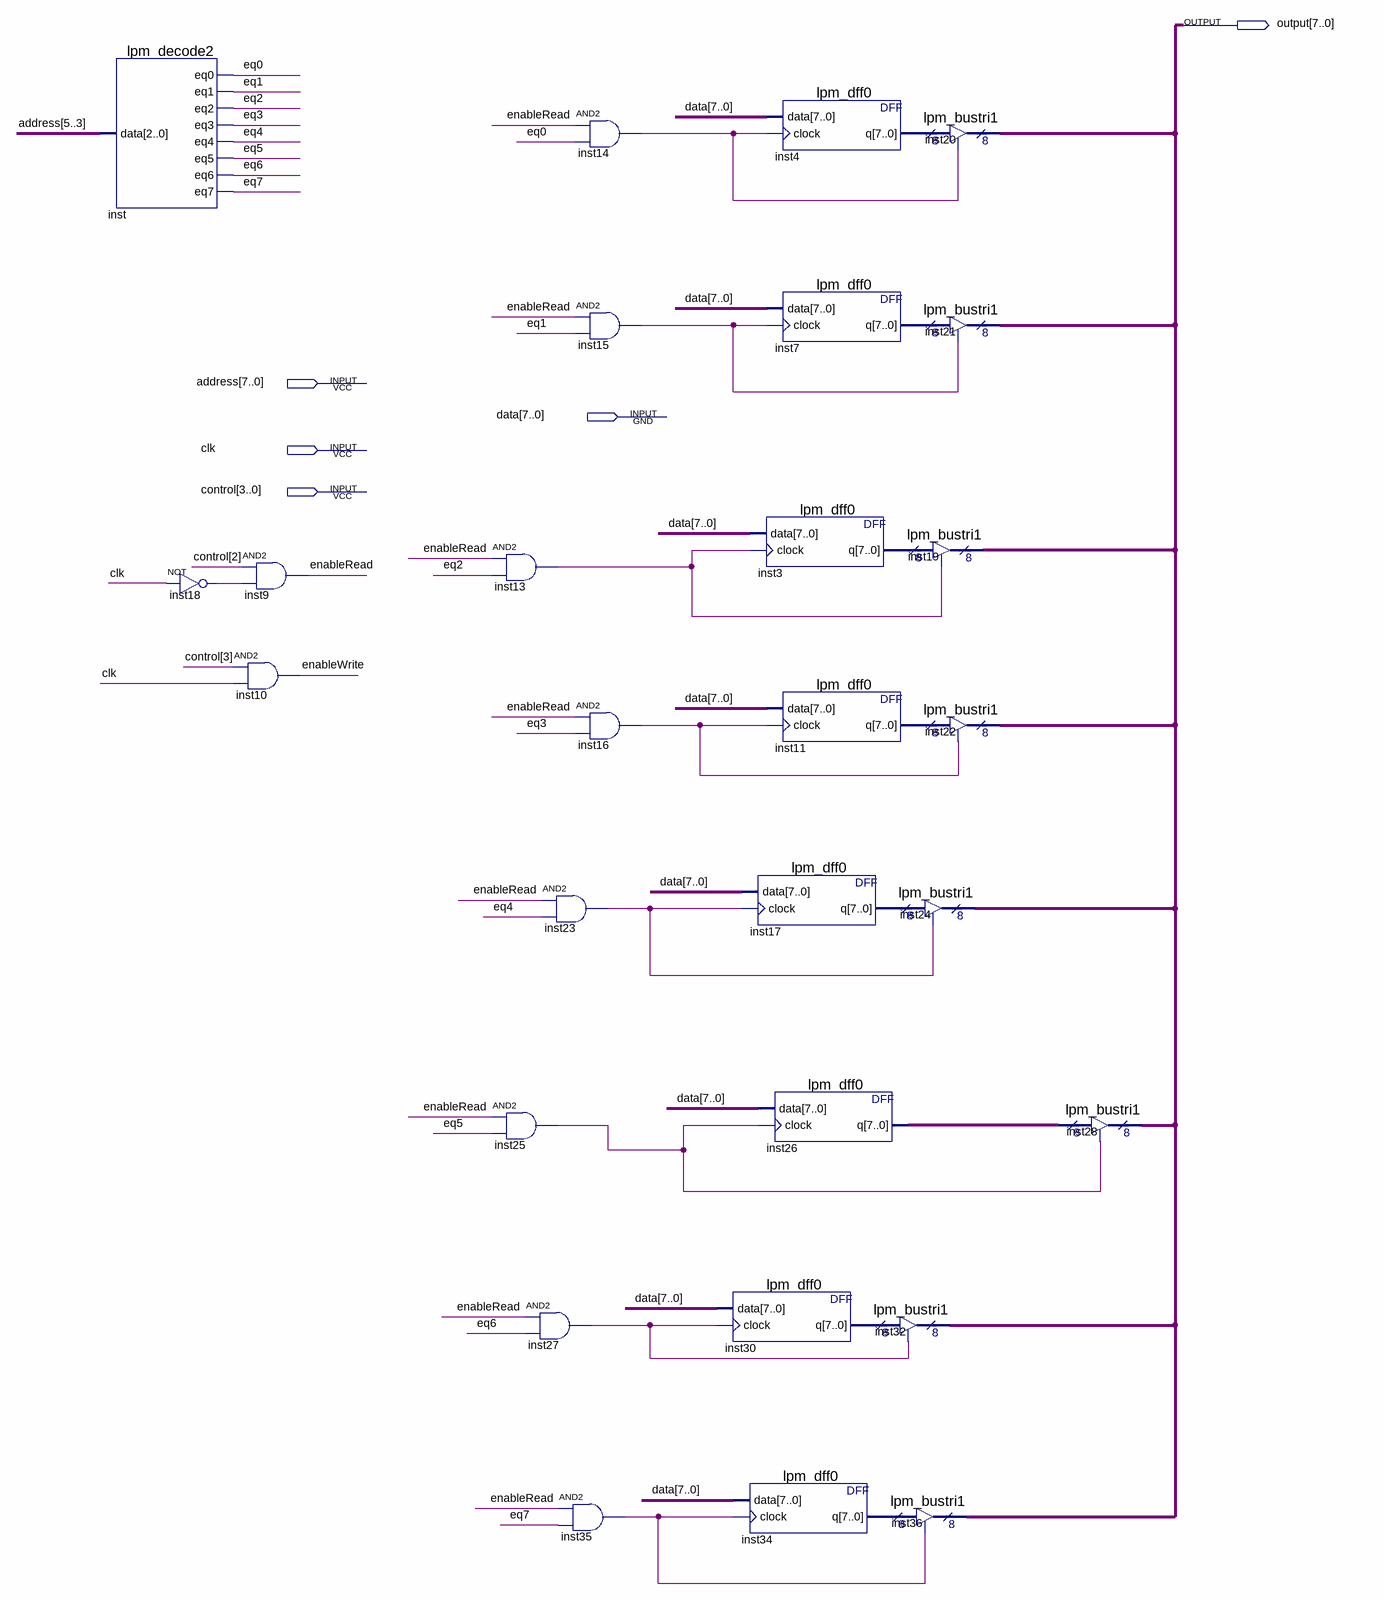
[diagram p0: schematic sheet]
// Quartus schematic POH.bdf as structural Verilog: 28 symbols, 5 pins
module POH (
  input  [7:0] address,
  input  [7:0] data,
  input  clk,
  input  [3:0] control,
  output [7:0] \output 
);

  wire enableRead, enableWrite, eq0, eq1, eq2, eq3, eq4, eq5, eq6, eq7, inst13_out, inst14_out, inst15_out,
       inst16_out, inst18_out, inst23_out, inst25_out, inst27_out, inst35_out;
  wire [7:0] inst3_q, inst4_q, inst7_q, inst11_q, inst17_q, inst26_q, inst30_q, inst34_q;

  lpm_decode2 inst (
    .data(address[5:3]), .eq0(eq0), .eq1(eq1), .eq2(eq2), .eq3(eq3), .eq4(eq4), .eq5(eq5), .eq6(eq6),
    .eq7(eq7));
  not inst18 (inst18_out, clk);
  and inst9 (enableRead, control[2], inst18_out);
  and inst10 (enableWrite, control[3], clk);
  and inst13 (inst13_out, enableRead, eq2);
  and inst23 (inst23_out, enableRead, eq4);
  and inst25 (inst25_out, enableRead, eq5);
  and inst27 (inst27_out, enableRead, eq6);
  and inst14 (inst14_out, enableRead, eq0);
  and inst15 (inst15_out, enableRead, eq1);
  and inst16 (inst16_out, enableRead, eq3);
  and inst35 (inst35_out, enableRead, eq7);
  lpm_dff0 inst17 (.data(data), .clock(inst23_out), .q(inst17_q));
  lpm_dff0 inst30 (.data(data), .clock(inst27_out), .q(inst30_q));
  lpm_dff0 inst34 (.data(data), .clock(inst35_out), .q(inst34_q));
  lpm_dff0 inst4 (.data(data), .clock(inst14_out), .q(inst4_q));
  lpm_dff0 inst7 (.data(data), .clock(inst15_out), .q(inst7_q));
  lpm_dff0 inst3 (.data(data), .clock(inst13_out), .q(inst3_q));
  lpm_dff0 inst11 (.data(data), .clock(inst16_out), .q(inst11_q));
  lpm_dff0 inst26 (.data(data), .clock(inst25_out), .q(inst26_q));
  lpm_bustri1 inst32 (.enabledt(inst27_out), .data(inst30_q), .tridata(\output ));
  lpm_bustri1 inst20 (.enabledt(inst14_out), .data(inst4_q), .tridata(\output ));
  lpm_bustri1 inst21 (.enabledt(inst15_out), .data(inst7_q), .tridata(\output ));
  lpm_bustri1 inst19 (.enabledt(inst13_out), .data(inst3_q), .tridata(\output ));
  lpm_bustri1 inst22 (.enabledt(inst16_out), .data(inst11_q), .tridata(\output ));
  lpm_bustri1 inst24 (.enabledt(inst23_out), .data(inst17_q), .tridata(\output ));
  lpm_bustri1 inst36 (.enabledt(inst35_out), .data(inst34_q), .tridata(\output ));
  lpm_bustri1 inst28 (.enabledt(inst25_out), .data(inst26_q), .tridata(\output ));
endmodule
